# EasyEDA Pro project 毕设.eprj, board PCB4
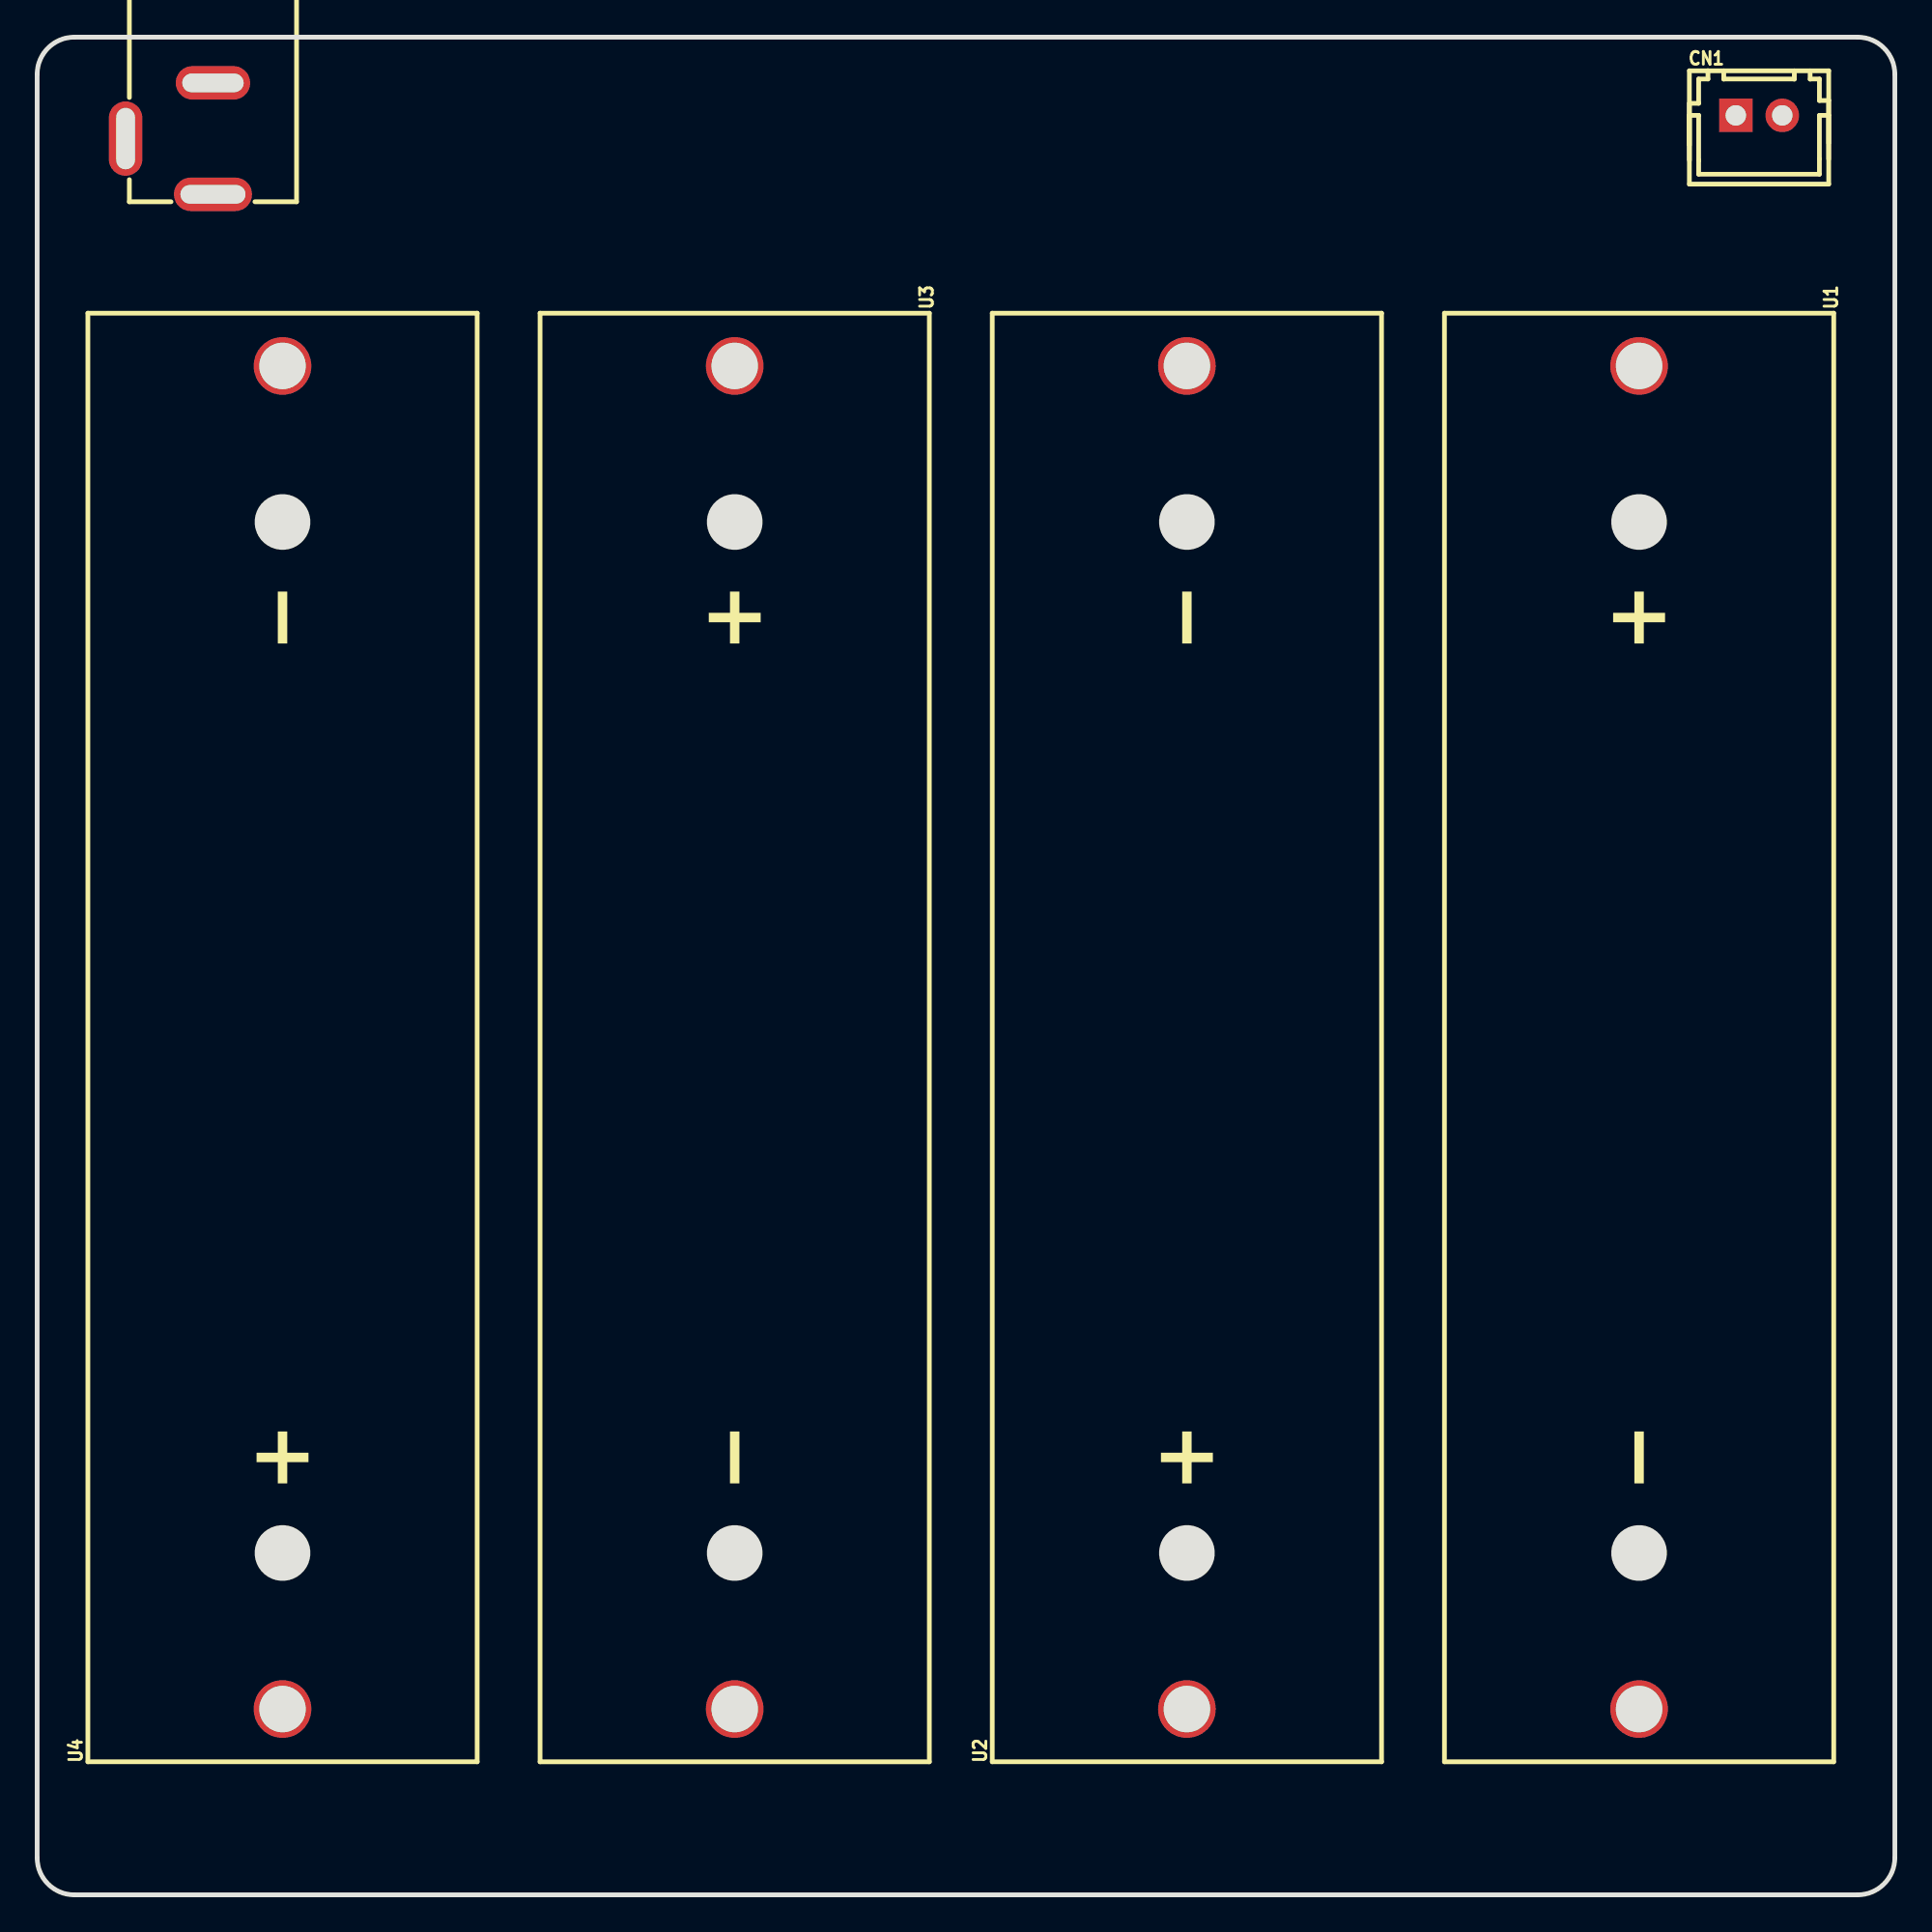
[diagram p5: board, top side]
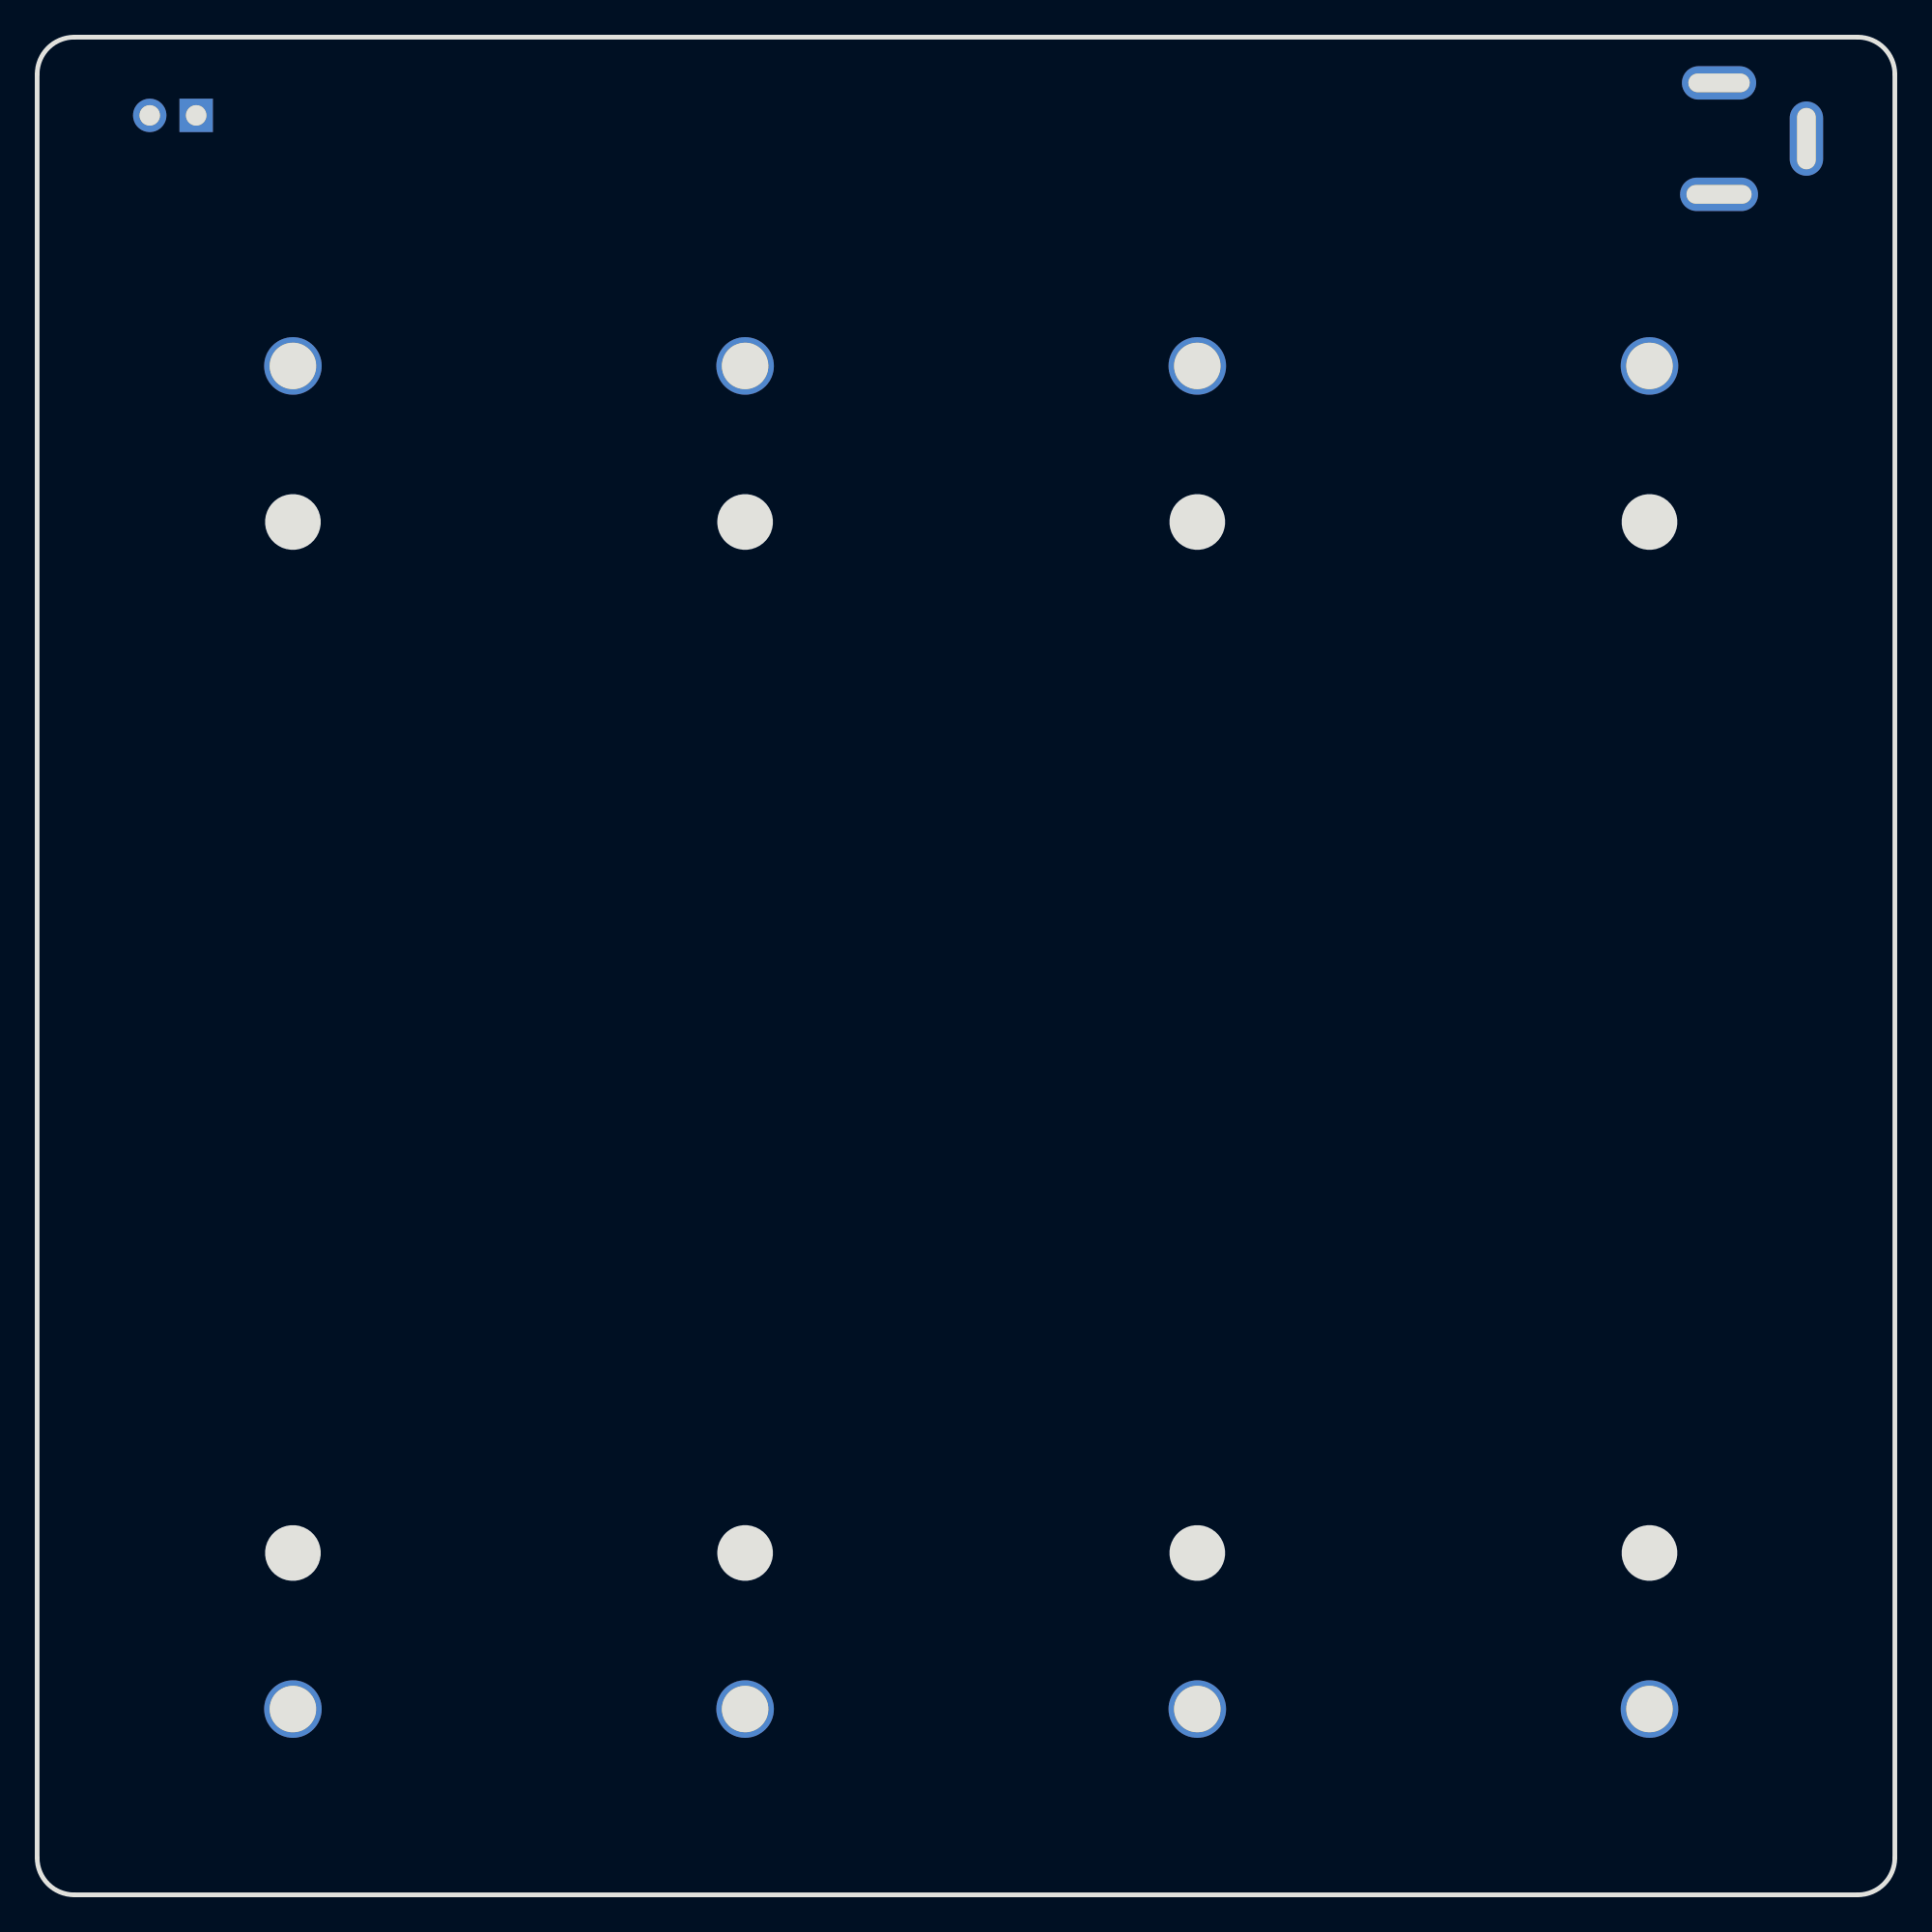
[diagram p6: board, bottom side, seen from below]

Outline 100 x 100 mm; copper layers: Top Layer, Bottom Layer. Coordinates in mm from the lower left corner of the outline.
Outline path: 0,98 0,2 arc(0.59,0.59) 2,0 98,0 arc(99.41,0.59) 100,2 100,98 arc(99.41,99.41) 98,100 2,100 arc(0.59,99.41) 0,98
Stack: Top Layer 0.035mm / Dielectric1 1.51mm FR4 er 4.5 / Bottom Layer 0.035mm

## Design rules (mm)
template: JLCPCB Capability(Two Layers Board)
spacing copperThickness1oz (default): track to track 0.102, other pairs 0.152 to 0.3
spacing copperThickness2oz: track to track 0.203, other pairs 0.152 to 0.3
track width copperThickness1oz (default): min 0.127, default 0.254, max 2.54
track width copperThickness2oz: min 0.203, default 0.254, max 2.54
differential pair differentialPair (default): width min 0.127, default 0.254, max 2.54; gap min 0.152, default 0.152
via viaSize (default): diameter min 0.5, default 0.61, max 10; hole min 0.3, default 0.305, max 6.3

## Placement (name value [footprint] x y rotation side)
CN1  ZX-XH2.54-2PZZ  [CONN-TH_2P-P2.50_HX25003-2A]  92.69 95.79 0 top
DC1  DC-005-5A-2.0  [DC-IN-TH_DC-005-5A-2.0]  7.11 94.54 270 top
U1  BH-18650-A5BJ001-2D  [BAT-TH_BH-18650-A5BJ001-2D]  86.23 46.15 270 top
U2  BH-18650-A5BJ001-2D  [BAT-TH_BH-18650-A5BJ001-2D]  61.89 46.15 90 top
U3  BH-18650-A5BJ001-2D  [BAT-TH_BH-18650-A5BJ001-2D]  37.55 46.15 270 top
U4  BH-18650-A5BJ001-2D  [BAT-TH_BH-18650-A5BJ001-2D]  13.21 46.15 90 top

## Footprints (pads in the part's own frame, mm; a bottom-side part is the same pattern mirrored in y, then rotated)
BAT-TH_BH-18650-A5BJ001-2D
  round 3.1 hole 2.5: 1(-36.15,0) 2(36.15,0)
CONN-TH_2P-P2.50_HX25003-2A
  rect 1.8x1.8 hole 1.1: 1(-1.25,0)
  round 1.8 hole 1.1: 2(1.25,0)
DC-IN-TH_DC-005-5A-2.0
  oval 1.8x4.2 hole 1x3.5: 1(3,2.352)
  oval 1.8x4 hole 1x3.3: 2(-3,2.352)
  oval 4x1.8 hole 3.3x1: 3(-0.001,-2.352)

## Nets
$1N199: U2.2 U3.1
$1N286: U3.2 U4.1
$1N349: CN1.2 DC1.2 DC1.3 U4.2
$1N536: CN1.1 DC1.1 U1.1
$1N539: U1.2 U2.1
